# EAGLE design HumanoidArduino (EAGLE 7.7.0)

## Sheet 1 of 2
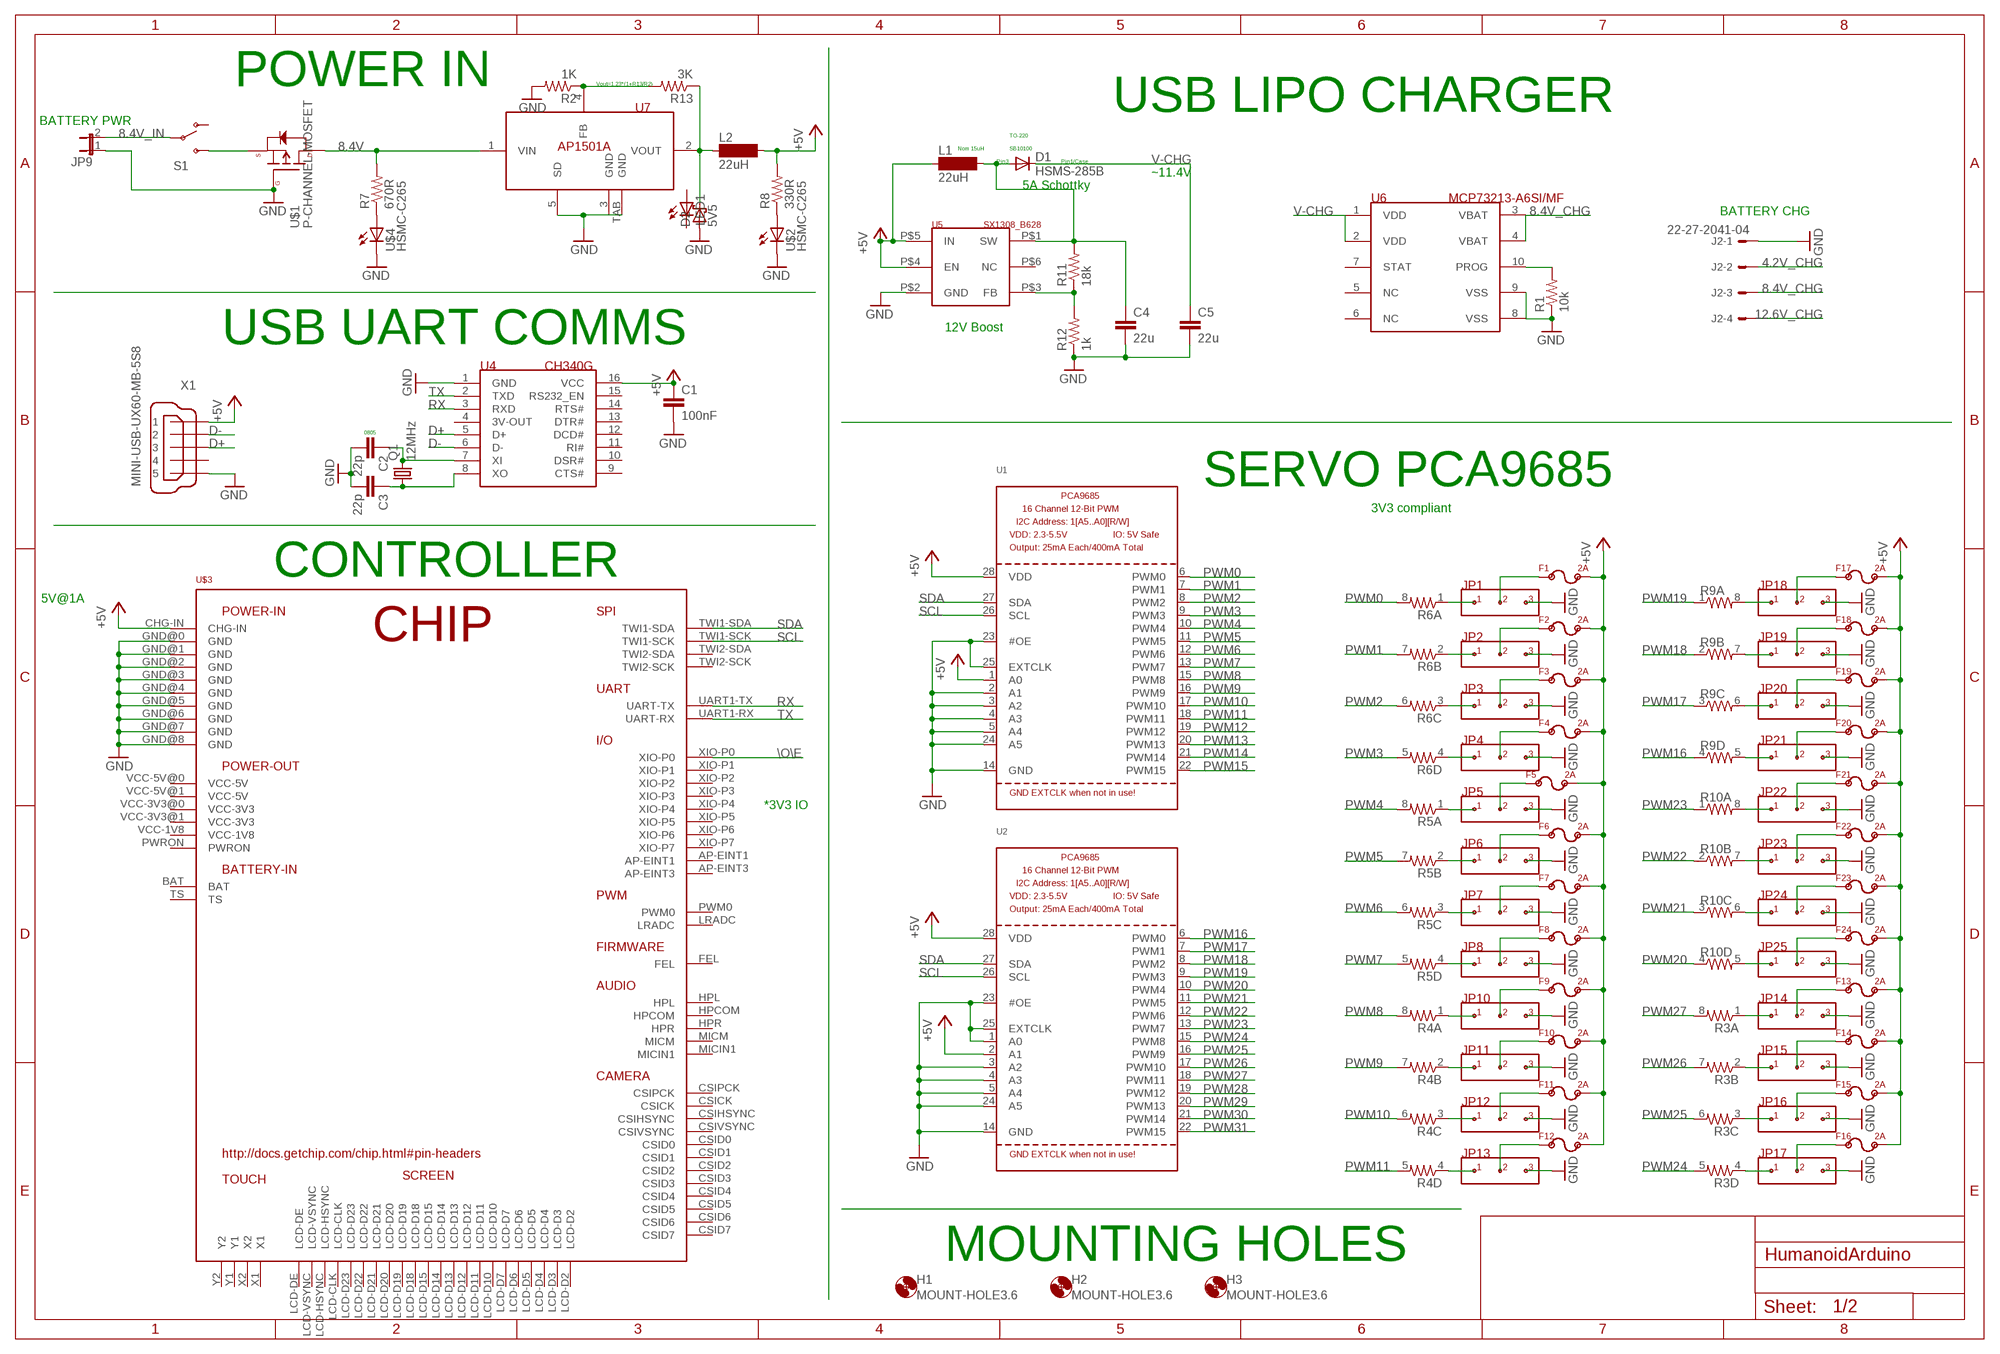
[diagram p0: schematic, sheet 1]

### Parts
C1  100nF  C2,5-3  [C2.5-3]
C2  22p  C2,5-3  [C2.5-3]
C3  22p  C2,5-3  [C2.5-3]
C4  22u  C2,5-3  [C2.5-3]
C5  22u  C2,5-3  [C2.5-3]
D1  HSMS-285B  [SOT323]
D2  5V5  BAT60J  [SOD323_ST]
F1  POLYSWITCH  [1206]
F2  POLYSWITCH  [1206]
F3  POLYSWITCH  [1206]
F4  POLYSWITCH  [1206]
F5  POLYSWITCH  [1206]
F6  POLYSWITCH  [1206]
F7  POLYSWITCH  [1206]
F8  POLYSWITCH  [1206]
F9  POLYSWITCH  [1206]
F10  POLYSWITCH  [1206]
F11  POLYSWITCH  [1206]
F12  POLYSWITCH  [1206]
F13  POLYSWITCH  [1206]
F14  POLYSWITCH  [1206]
F15  POLYSWITCH  [1206]
F16  POLYSWITCH  [1206]
F17  POLYSWITCH  [1206]
F18  POLYSWITCH  [1206]
F19  POLYSWITCH  [1206]
F20  POLYSWITCH  [1206]
F21  POLYSWITCH  [1206]
F22  POLYSWITCH  [1206]
F23  POLYSWITCH  [1206]
F24  POLYSWITCH  [1206]
H1  MOUNT-HOLE3.6  [3,6]
H2  MOUNT-HOLE3.6  [3,6]
H3  MOUNT-HOLE3.6  [3,6]
J2  22-27-2041-04  [6410-04]
JP1  JUMPER_3X1_0.1  [CONN_3X1_0.1"]
JP2  JUMPER_3X1_0.1  [CONN_3X1_0.1"]
JP3  JUMPER_3X1_0.1  [CONN_3X1_0.1"]
JP4  JUMPER_3X1_0.1  [CONN_3X1_0.1"]
JP5  JUMPER_3X1_0.1  [CONN_3X1_0.1"]
JP6  JUMPER_3X1_0.1  [CONN_3X1_0.1"]
JP7  JUMPER_3X1_0.1  [CONN_3X1_0.1"]
JP8  JUMPER_3X1_0.1  [CONN_3X1_0.1"]
JP9  JP1E  [JP1]
JP10  JUMPER_3X1_0.1  [CONN_3X1_0.1"]
JP11  JUMPER_3X1_0.1  [CONN_3X1_0.1"]
JP12  JUMPER_3X1_0.1  [CONN_3X1_0.1"]
JP13  JUMPER_3X1_0.1  [CONN_3X1_0.1"]
JP14  JUMPER_3X1_0.1  [CONN_3X1_0.1"]
JP15  JUMPER_3X1_0.1  [CONN_3X1_0.1"]
JP16  JUMPER_3X1_0.1  [CONN_3X1_0.1"]
JP17  JUMPER_3X1_0.1  [CONN_3X1_0.1"]
JP18  JUMPER_3X1_0.1  [CONN_3X1_0.1"]
JP19  JUMPER_3X1_0.1  [CONN_3X1_0.1"]
JP20  JUMPER_3X1_0.1  [CONN_3X1_0.1"]
JP21  JUMPER_3X1_0.1  [CONN_3X1_0.1"]
JP22  JUMPER_3X1_0.1  [CONN_3X1_0.1"]
JP23  JUMPER_3X1_0.1  [CONN_3X1_0.1"]
JP24  JUMPER_3X1_0.1  [CONN_3X1_0.1"]
JP25  JUMPER_3X1_0.1  [CONN_3X1_0.1"]
L1  22uH  MS85  [MS85]
L2  22uH  MS85  [MS85]
LED1  LEDSML1206  [SML1206]
Q1  12MHz  CSM-7X-DU  [CSM-7X-DU]
R1  10k  RESISTOR0805-RES  [0805]
R2  1K  RESISTOR0805-RES  [0805]
R3  RESISTOR-ARRAY0603-ARV  [0603-ARV]
R4  RESISTOR-ARRAY0603-ARV  [0603-ARV]
R5  RESISTOR-ARRAY0603-ARV  [0603-ARV]
R6  RESISTOR-ARRAY0603-ARV  [0603-ARV]
R7  670R  RESISTOR0805-RES  [0805]
R8  330R  RESISTOR0805-RES  [0805]
R9  RESISTOR-ARRAY0603-ARV  [0603-ARV]
R10  RESISTOR-ARRAY0603-ARV  [0603-ARV]
R11  18k  RESISTOR0805-RES  [0805]
R12  1k  RESISTOR0805-RES  [0805]
R13  3K  RESISTOR0805-RES  [0805]
S1  SWITCH-SPDTPTH_LOCK  [SWITCH-SPDT_LOCK.007S]
U1  PCA9685  [TSSOP28]
U2  PCA9685  [TSSOP28]
U4  CH340G  [SO-16]
U5  SX1308_B628  [SOT23-6]
U6  MCP73213-A6SI/MF  [DFN300X300X100-11N]
U7  AP1501A  [TO-263-5]
U$1  P-CHANNEL-MOSFET  [SOT23-3]
U$2  HSMC-C265  [HSMC-C265]
U$3  CHIP  [CHIP]
U$4  HSMC-C265  [HSMC-C265]
X1  MINI-USB-UX60-MB-5S8  [UX60-MB-5S8]

### Nets
4.2V_CHG: J2.2
8.4V: R7.2 U7.1(VIN) U$1.3(D)
8.4V_CHG: J2.3
8.4V_IN: JP9.2 S1.2(P)
12.6V_CHG: J2.4
+5V: C1.1 F1.P$2 F2.P$2 F3.P$2 F4.P$2 F5.P$2 F6.P$2 F7.P$2 F8.P$2 F9.P$2 F10.P$2 F11.P$2 F12.P$2 F13.P$2 F14.P$2 F15.P$2 F16.P$2 F17.P$2 F18.P$2 F19.P$2 F20.P$2 F21.P$2 F22.P$2 F23.P$2 F24.P$2 L2.2 R8.2 U1.1(A0) U1.28(VDD) U2.2(A1) U2.28(VDD) U4.16(VCC) U$3.CHG-IN X1.1
\O\E: U$3.XIO-P0
D+: U4.5(D+) X1.3
D-: U4.6(D-) X1.2
GND: C1.2 C2.2 C3.2 C4.2 C5.2 D2.A J2.1 JP1.P$3 JP2.P$3 JP3.P$3 JP4.P$3 JP5.P$3 JP6.P$3 JP7.P$3 JP8.P$3 JP9.1 JP10.P$3 JP11.P$3 JP12.P$3 JP13.P$3 JP14.P$3 JP15.P$3 JP16.P$3 JP17.P$3 JP18.P$3 JP19.P$3 JP20.P$3 JP21.P$3 JP22.P$3 JP23.P$3 JP24.P$3 JP25.P$3 R1.1 R2.2 R12.1 U1.2(A1) U1.3(A2) U1.4(A3) U1.5(A4) U1.14(GND) U1.23(#OE) U1.24(A5) U1.25(EXTCLK) U2.1(A0) U2.3(A2) U2.4(A3) U2.5(A4) U2.14(GND) U2.23(#OE) U2.24(A5) U2.25(EXTCLK) U4.1(GND) U5.P$2(GND) U6.9(VSS) U7.5(SD) U7.TAB(GND) U$1.1(G) U$2.C U$3.GND@0(GND) U$3.GND@1(GND) U$3.GND@2(GND) U$3.GND@3(GND) U$3.GND@4(GND) U$3.GND@5(GND) U$3.GND@6(GND) U$3.GND@7(GND) U$3.GND@8(GND) U$4.C X1.5
N$2: JP1.P$1 R6.1
N$3: JP2.P$1 R6.2
N$4: JP3.P$1 R6.3
N$5: JP4.P$1 R6.4
N$6: F3.P$1 JP3.P$2
N$7: F4.P$1 JP4.P$2
N$8: F16.P$1 JP17.P$2
N$9: F15.P$1 JP16.P$2
N$10: F14.P$1 JP15.P$2
N$11: F13.P$1 JP14.P$2
N$12: F12.P$1 JP13.P$2
N$13: F11.P$1 JP12.P$2
N$14: F10.P$1 JP11.P$2
N$15: F9.P$1 JP10.P$2
N$16: F8.P$1 JP8.P$2
N$17: F7.P$1 JP7.P$2
N$18: F6.P$1 JP6.P$2
N$19: F5.P$1 JP5.P$2
N$20: JP5.P$1 R5.1
N$21: JP6.P$1 R5.2
N$22: JP7.P$1 R5.3
N$23: JP8.P$1 R5.4
N$24: JP10.P$1 R4.1
N$25: JP11.P$1 R4.2
N$26: S1.3(S) U$1.2(S)
N$27: F1.P$1 JP1.P$2
N$28: R7.1 U$4.A
N$29: R8.1 U$2.A
N$30: F2.P$1 JP2.P$2
N$31: JP12.P$1 R4.3
N$32: JP13.P$1 R4.4
N$33: JP14.P$1 R3.1
N$34: JP15.P$1 R3.2
N$35: JP16.P$1 R3.3
N$36: JP17.P$1 R3.4
N$38: F21.P$1 JP22.P$2
N$39: F20.P$1 JP21.P$2
N$40: F19.P$1 JP20.P$2
N$41: F18.P$1 JP19.P$2
N$42: F17.P$1 JP18.P$2
N$43: JP18.P$1 R9.8
N$44: JP19.P$1 R9.7
N$45: JP20.P$1 R9.6
N$46: JP21.P$1 R9.5
N$47: JP22.P$1 R10.8
N$48: F22.P$1 JP23.P$2
N$49: F23.P$1 JP24.P$2
N$50: F24.P$1 JP25.P$2
N$53: JP23.P$1 R10.7
N$54: JP24.P$1 R10.6
N$55: JP25.P$1 R10.5
N$56: C2.1 Q1.2 U4.7(XI)
N$57: C3.1 Q1.1 U4.8(XO)
N$58: L1.1 U5.P$4(EN) U5.P$5(IN) ; supply symbol labelled +5V
N$59: R11.1 R12.2 U5.P$3(FB)
N$60: C4.1 D1.1(A) L1.2 R11.2 U5.P$1(SW)
N$62: U6.2(VDD)
N$63: U6.4(VBAT)
N$64: R1.2 U6.10(PROG)
N$65: R2.1 R13.2 U7.4(FB)
N$66: D2.C L2.1 R13.1 U7.2(VOUT)
PWM0: R6.8 U1.6(PWM0)
PWM1: R6.7 U1.7(PWM1)
PWM2: R6.6 U1.8(PWM2)
PWM3: R6.5 U1.9(PWM3)
PWM4: R5.8 U1.10(PWM4)
PWM5: R5.7 U1.11(PWM5)
PWM6: R5.6 U1.12(PWM6)
PWM7: R5.5 U1.13(PWM7)
PWM8: R4.8 U1.15(PWM8)
PWM9: R4.7 U1.16(PWM9)
PWM10: R4.6 U1.17(PWM10)
PWM11: R4.5 U1.18(PWM11)
PWM12: U1.19(PWM12)
PWM13: U1.20(PWM13)
PWM14: U1.21(PWM14)
PWM15: U1.22(PWM15)
PWM16: R9.4 U2.6(PWM0)
PWM17: R9.3 U2.7(PWM1)
PWM18: R9.2 U2.8(PWM2)
PWM19: R9.1 U2.9(PWM3)
PWM20: R10.4 U2.10(PWM4)
PWM21: R10.3 U2.11(PWM5)
PWM22: R10.2 U2.12(PWM6)
PWM23: R10.1 U2.13(PWM7)
PWM24: R3.5 U2.15(PWM8)
PWM25: R3.6 U2.16(PWM9)
PWM26: R3.7 U2.17(PWM10)
PWM27: R3.8 U2.18(PWM11)
PWM28: U2.19(PWM12)
PWM29: U2.20(PWM13)
PWM30: U2.21(PWM14)
PWM31: U2.22(PWM15)
RX: U4.3(RXD) U$3.UART1-TX(UART-TX)
SCL: U1.26(SCL) U2.26(SCL) U$3.TWI1-SCK
SDA: U1.27(SDA) U2.27(SDA) U$3.TWI1-SDA
TX: U4.2(TXD) U$3.UART1-RX(UART-RX)
V-CHG: C5.1 D1.3(C)
Unconnected: LED1.A LED1.C S1.1(O) U4.4(3V-OUT) U4.9(CTS#) U4.10(DSR#) U4.11(RI#) U4.12(DCD#) U4.13(DTR#) U4.14(RTS#) U4.15(RS232_EN) U5.P$6(NC) U6.1(VDD) U6.3(VBAT) U6.5(NC) U6.6(NC) U6.7(STAT) U6.8(VSS) U7.3(GND) U$3.AP-EINT1 U$3.AP-EINT3 U$3.BAT U$3.CSICK U$3.CSID0 U$3.CSID1 U$3.CSID2 U$3.CSID3 U$3.CSID4 U$3.CSID5 U$3.CSID6 U$3.CSID7 U$3.CSIHSYNC U$3.CSIPCK U$3.CSIVSYNC U$3.FEL U$3.HPCOM U$3.HPL U$3.HPR U$3.LCD-CLK U$3.LCD-D2 U$3.LCD-D3 U$3.LCD-D4 U$3.LCD-D5 U$3.LCD-D6 U$3.LCD-D7 U$3.LCD-D10 U$3.LCD-D11 U$3.LCD-D12 U$3.LCD-D13 U$3.LCD-D14 U$3.LCD-D15 U$3.LCD-D18 U$3.LCD-D19 U$3.LCD-D20 U$3.LCD-D21 U$3.LCD-D22 U$3.LCD-D23 U$3.LCD-DE U$3.LCD-HSYNC U$3.LCD-VSYNC U$3.LRADC U$3.MICIN1 U$3.MICM U$3.PWM0 U$3.PWRON U$3.TS U$3.TWI2-SCK U$3.TWI2-SDA U$3.VCC-1V8 U$3.VCC-3V3@0(VCC-3V3) U$3.VCC-3V3@1(VCC-3V3) U$3.VCC-5V@0(VCC-5V) U$3.VCC-5V@1(VCC-5V) U$3.X1 U$3.X2 U$3.XIO-P1 U$3.XIO-P2 U$3.XIO-P3 U$3.XIO-P4 U$3.XIO-P5 U$3.XIO-P6 U$3.XIO-P7 U$3.Y1 U$3.Y2 X1.4

### Notes on the sheet
- POWER IN | Vout=1.23*(1+R13/R2)
- USB LIPO CHARGER
- BATTERY PWR
- TO-220
- Nom 15uH | SB10100
- Pin3 | Pin1/Case
- ~11.4V
- 5A Schottky
- BATTERY CHG
- 12V Boost
- USB UART COMMS
- 0805
- SERVO PCA9685
- ￼ ✓ 3V3 compliant
- CONTROLLER
- 5V@1A
- *3V3 IO
- MOUNTING HOLES

## Sheet 2 of 2

## Library data of the parts
C1-C5 = capacitor-wima:C: CAPACITOR naming: grid - package width
D1 = avago:HSMS-285B: Surface Mount Microwave Schottky Detector Diodes Source: Data sheet <http://www.farnell.com/datasheets/461166.pdf>
D2 = diode:BAT60J: Schottky barrier diode Source: www.st.com, BAT60J.pdf
F1-F24 = HumanoidLbr:POLYSWITCH; CURRENT: 2A
H1-H3 = holes:MOUNT-HOLE: MOUNTING HOLE with drill center marker
J2 = con-molex:22-?-04: CONNECTOR wire to board 2.54 mm (.1 inch) pitch header; OC_FARNELL: unknown; OC_NEWARK: unknown
JP1-JP8 JP10-JP25 = HumanoidLbr:JUMPER_3X1_0.1
JP9 = jumper:JP1E: JUMPER
L1 L2 = inductor-neosid:MS85: INDUCTOR SMD power inductor; OC_FARNELL: unknown; OC_NEWARK: unknown
LED1 = led:LED: LED OSRAM: - CHIPLED LG R971, LG N971, LY N971, LG Q971, LY Q971, LO R971, LY R971 LH N974, LH R974 LS Q976, LO Q976, LY Q976 LO Q996 - Hyper CHIPLED LW Q18S LB Q993, LB Q99A, LB R99A - SideLED LS A670, LO A670, LY A670, LG A670, LP A670 LB A673, LV A673, LT A673, LW A673 LH A674 LY A675 LS A676, LA A676, LO A676, LY A676, LW A676 LS A679, LY A679, LG A679 - Hyper Micro SIDELED® LS Y876, LA Y876, LO Y876, LY Y876 LT Y87S - SmartLED LW L88C, LW L88S LB L89C, LB L89S, LG L890 LS L89K, LO L89K, LY L89K LS L896, LA L896, LO L896, LY L896 - TOPLED LS T670, LO T670, LY T670, LG T670, LP T670 LSG T670, LSP T670, LSY T670, LOP T670, LYG T670 LG T671, LOG T671, LSG T671 LB T673, LV T673, LT T673, LW T673 LH T674 LS T676, LA T676, LO T676, LY T676, LB T676, LH T676, LSB T676, LW T676 LB T67C, LV T67C, LT T67C, LS T67K, LO T67K, LY T67K, LW E67C LS E67B, LA E67B, LO E67B, LY E67B, LB E67C, LV E67C, LT E67C LW T67C LS T679, LY T679, LG T679 LS T770, LO T770, LY T770, LG T770, LP T770 LB T773, LV T773, LT T773, LW T773 LH T774 LS E675, LA E675, LY E675, LS T675 LS T776, LA T776, LO T776, LY T776, LB T776 LHGB T686 LT T68C, LB T68C - Hyper Mini TOPLED® LB M676 - Mini TOPLED Santana® LG M470 LS M47K, LO M47K, LY M47K Source: http://www.osram.convergy.de LUXEON: - LUMILED® LXK2-PW12-R00, LXK2-PW12-S00, LXK2-PW14-U00, LXK2-PW14-V00 LXK2-PM12-R00, LXK2-PM12-S00, LXK2-PM14-U00 LXK2-PE12-Q00, LXK2-PE12-R00, LXK2-PE12-S00, LXK2-PE14-T00, LXK2-PE14-U00 LXK2-PB12-K00, LXK2-PB12-L00, LXK2-PB12-M00, LXK2-PB14-N00, LXK2-PB14-P00, LXK2-PB14-Q00 LXK2-PR12-L00, LXK2-PR12-M00, LXK2-PR14-Q00, LXK2-PR14-R00 LXK2-PD12-Q00, LXK2-PD12-R00, LXK2-PD12-S00 LXK2-PH12-R00, LXK2-PH12-S00 LXK2-PL12-P00, LXK2-PL12-Q00, LXK2-PL12-R00 Source: www.luxeon.com KINGBRIGHT: KA-3528ASYC Source: www.kingbright.com
Q1 = crystal:CSM-7X-DU: SMD CRYSTAL Source: www.ecsxtal.com .. Crystal 3.6864MHz CSM_7X_DU.PDF; OC_FARNELL: unknown; OC_NEWARK: unknown
R1 R2 R7 R8 R11-R13 = SparkFun-Passives:RESISTOR: Resistor Basic schematic elements and footprints for 0603, 1206, and PTH resistors.
R3-R6 R9 R10 = SparkFun-Resistors:RESISTOR-ARRAY: Array Chip Resistor Source: RS Component / Phycomp
S1 = SparkFun-Electromechanical:SWITCH-SPDT: SPDT Switch Simple slide switch, Spark Fun Electronics SKU : COM-00102 DPDT SMT slide switch, AYZ0202, SWCH-08179
U1 U2 = adafruit:PCA9685: PCA9685 - 16 Channel 12-Bit I2C PWM Controller 5.0V tolerant 16 channel, 12-bit I2C PWM controller with 25mA per output (max. 400mA total) Digikey: 568-5931-1-ND
U4 = HumanoidLbr:CH340G
U5 = HumanoidLbr:SX1308_B628
U6 = DFN300X300X100-11N:MCP73213-A6SI/MF
U7 = TO-263-5:AP1501A
U$1 = GeekAmmo:P-CHANNEL-MOSFET: P-Channel MOSFET Mode Field Effect Transistor
U$2 U$4 = SparkFun-Retired:HSMC-C265: RETIRED Avago HSMC-C265 reverse-mounted red LED This is a SMD LED that is mounted to one side of a PCB and shines through a hole to the other side of the PCB. Useful for making boards with no components on one side for mounting and having LED indicator lights shine through the board, panel, etc.
U$3 = ZMZE:CHIP
X1 = con-hirose:MINI-USB-: MINI USB Connector Source: http://www.hirose.co.jp/cataloge_hp/e24000019.pdf; OC_FARNELL: unknown; OC_NEWARK: unknown

## Board
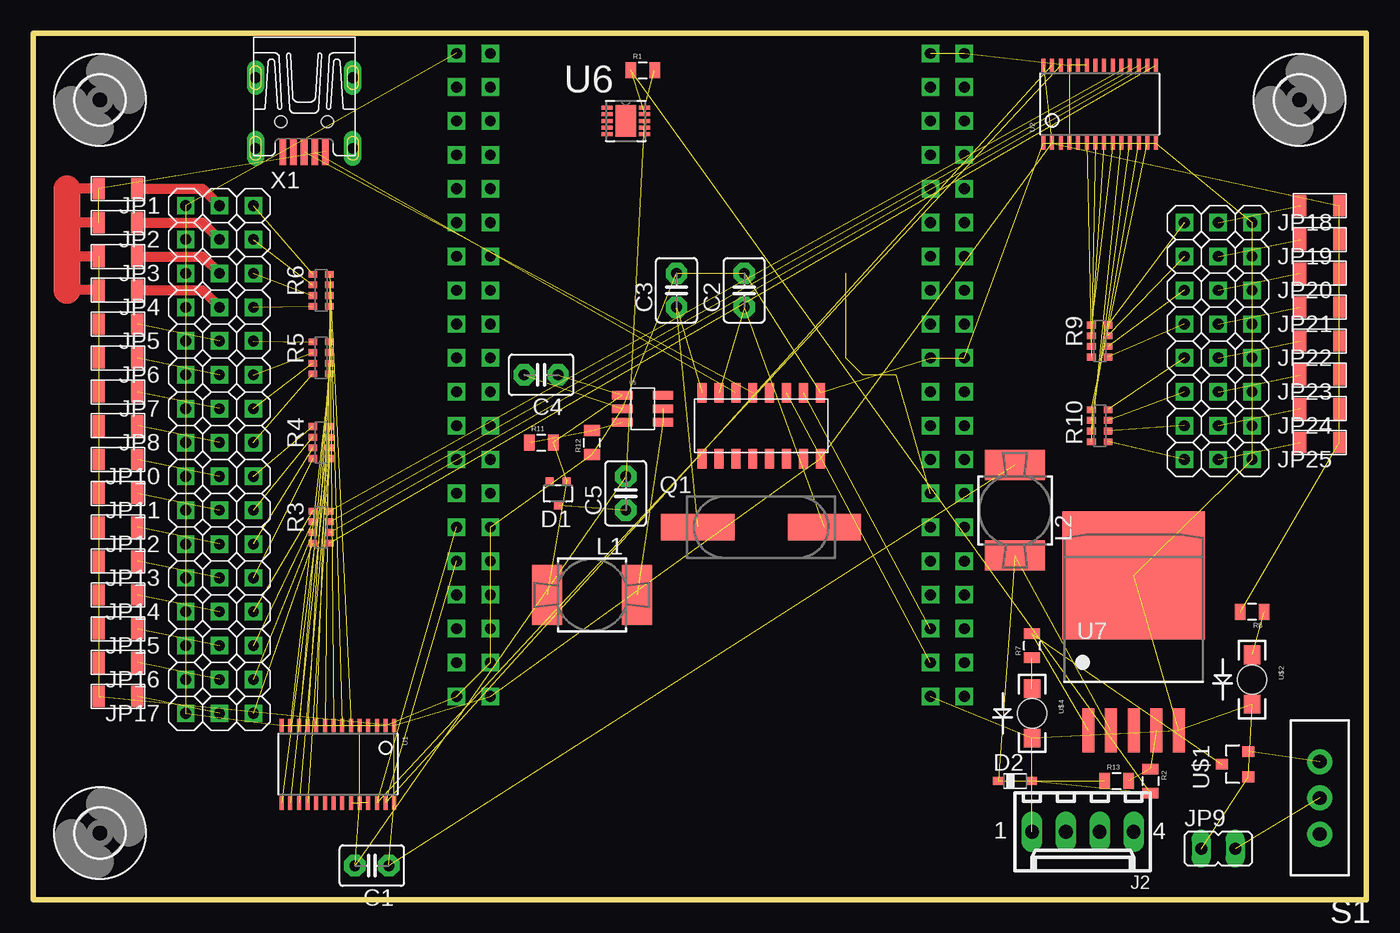
[diagram p1: board, top side]
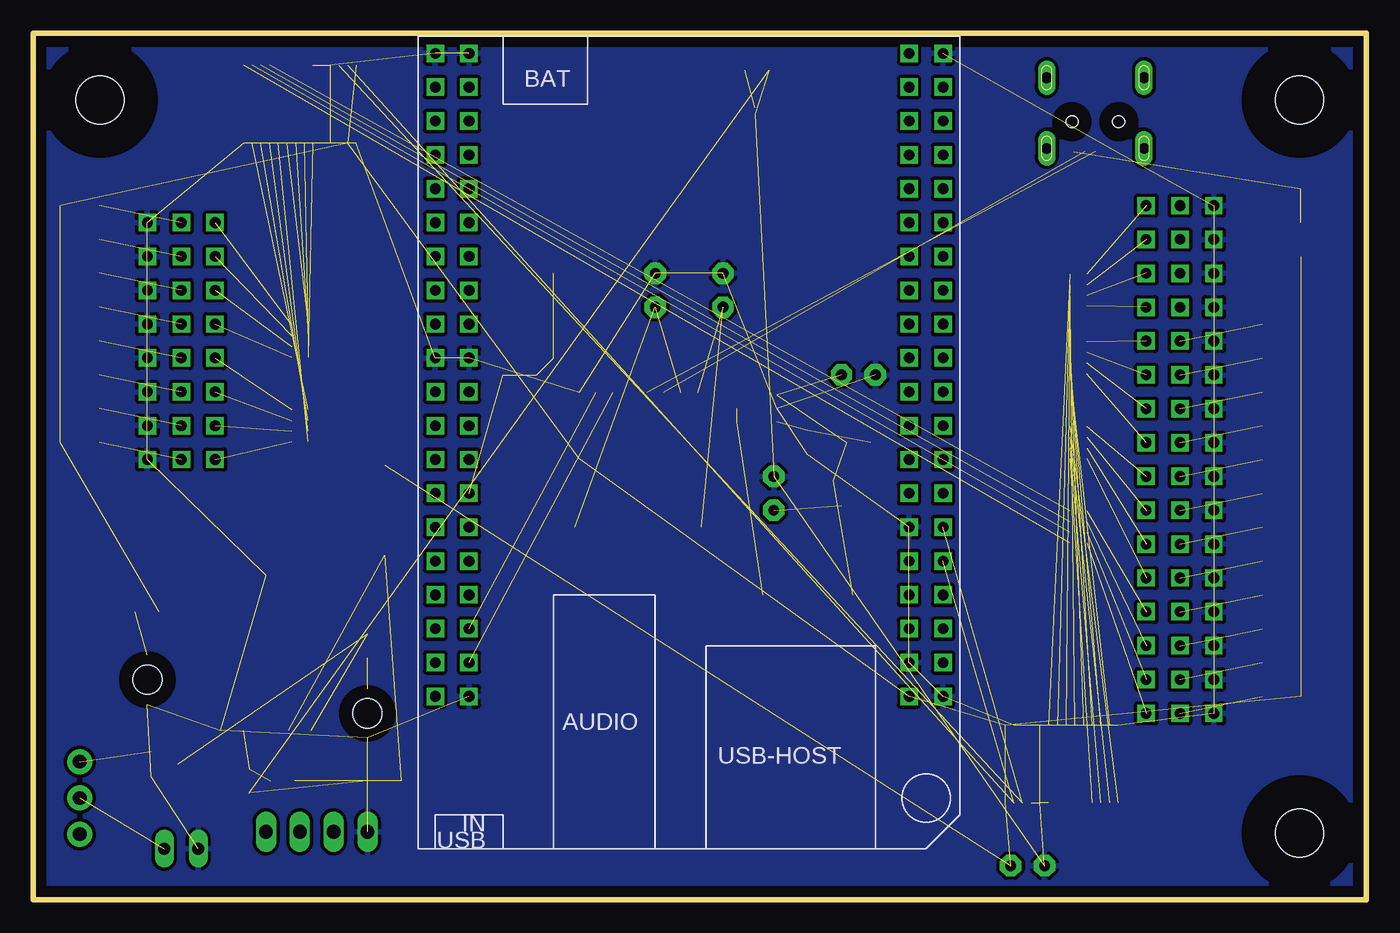
[diagram p2: board, bottom side, seen from below]

Size 100 x 65 mm. Coordinates in mm from the lower left corner, seen from the top.
Outline: 0,0 100,0 100,65 0,65 0,0
Copper layers (1*16): Top 0.035mm / dielectric 1.5mm / Bottom 0.035mm
Design rules "default": minimum track width 10mil, minimum drill 24mil, track to track 8mil, track to pad 8mil, pad to pad 8mil, via to via 8mil, smd to smd 8mil, copper to edge 40mil, drill to drill 8mil, minimum pad ring 10mil, minimum via ring 8mil, stop-mask expansion 4mil, vias tented up to drill 0mil, thermal gap 10mil
Milling: 4 lines

### Footprints (pad centres in the part's own frame; a part is rotated, then mirrored left to right if it is on the bottom)
C2.5-3 = drill 0.813 pad 1.6 octagon: 1 -1.27,0; 2 1.27,0
SOT323 = smd 0.6 x 0.55: 1 -0.65,-0.925; 2 0.65,-0.925; 3 0,0.925
SOD323_ST = smd 0.8 x 0.6: A 1.25,0; C -1.25,0
1206 = smd 0.9 x 1.6: P$1 1.45,0; P$2 -1.45,0
3,6 = hole 3.6: 0,0
6410-04 = drill 1.016 long: 1 3.81,0; 2 1.27,0; 3 -1.27,0; 4 -3.81,0
CONN_3X1_0.1" = drill 0.8 square: P$1 -2.54,0; P$2 0,0; P$3 2.54,0
JP1 = drill 0.914 long: 1 0,-1.27; 2 0,1.27
MS85 = smd 4.5 x 2.25: 1 0,-3.383; 2 0,3.383
SML1206 = smd 1.5 x 1.5: A 1.75,0; C -1.75,0
CSM-7X-DU = smd 5.5 x 2: 1 -4.75,0; 2 4.75,0
0805 = smd 0.8 x 1.2: 1 -0.9,0; 2 0.9,0
0603-ARV = smd 0.5 x 0.65: 1 -1.2,-0.625; 2 -0.4,-0.625; 3 0.4,-0.625; 4 1.2,-0.625; 5 1.2,0.625; 6 0.4,0.625; 7 -0.4,0.625; 8 -1.2,0.625
SWITCH-SPDT_LOCK.007S = drill 1.016 pad 1.88: 1 0,2.718; 2 0,0; 3 0,-2.718
TSSOP28 = smd 0.305 x 0.991: 1 -4.225,-2.918; 2 -3.575,-2.918; 3 -2.925,-2.918; 4 -2.275,-2.918; 5 -1.625,-2.918; 6 -0.975,-2.918; 7 -0.325,-2.918; 8 0.325,-2.918; 9 0.975,-2.918; 10 1.625,-2.918; 11 2.275,-2.918; 12 2.925,-2.918; 13 3.575,-2.918; 14 4.225,-2.918; 15 4.225,2.918; 16 3.575,2.918; 17 2.925,2.918; 18 2.275,2.918; 19 1.625,2.918; 20 0.975,2.918; 21 0.325,2.918; 22 -0.325,2.918; 23 -0.975,2.918; 24 -1.625,2.918; 25 -2.275,2.918; 26 -2.925,2.918; 27 -3.575,2.918; 28 -4.225,2.918
SO-16 = smd 1.45 x 0.67: 1 -2.475,4.445; 2 -2.475,3.175; 3 -2.475,1.905; 4 -2.475,0.635; 5 -2.475,-0.635; 6 -2.475,-1.905; 7 -2.475,-3.175; 8 -2.475,-4.445; 9 2.475,-4.445; 10 2.475,-3.175; 11 2.475,-1.905; 12 2.475,-0.635; 13 2.475,0.635; 14 2.475,1.905; 15 2.475,3.175; 16 2.475,4.445
SOT23-6 = smd 1.524 x 0.635: P$1 -1.524,1.016; P$2 -1.524,0; P$3 -1.524,-1.016; P$4 1.524,-1.016; P$5 1.524,0; P$6 1.524,1.016
DFN300X300X100-11N = smd 0.813 x 0.305: 1 -1.397,0.991; 2 -1.397,0.508; 3 -1.397,0; 4 -1.397,-0.508; 5 -1.397,-0.991; 6 1.397,-0.991; 7 1.397,-0.508; 8 1.397,0; 9 1.397,0.508; 10 1.397,0.991 | smd 1.575 x 2.362: 11 0,0
TO-263-5 = smd 0.9 x 3.3: 1 -3.4,0; 2 -1.7,0; 3 0,0; 4 1.7,0; 5 3.4,0 | smd 10.7 x 9.6: TAB 0,11.616
SOT23-3 = smd 0.8 x 0.9: 1 -0.95,-1; 2 0.95,-1; 3 0,1
HSMC-C265 = smd 1.4 x 1.25: A -1.85,0; C 1.85,0 | hole 2.2: 0,0
CHIP = drill 0.8 square: AP-EINT1 35.56,20.32; AP-EINT3 38.1,20.32; BAT 2.54,40.64; CHG-IN 2.54,48.26; CSICK 38.1,15.24; CSID0 35.56,10.16; CSID1 38.1,10.16; CSID2 35.56,7.62; CSID3 38.1,7.62; CSID4 35.56,5.08; CSID5 38.1,5.08; CSID6 35.56,2.54; CSID7 38.1,2.54; CSIHSYNC 35.56,12.7; CSIPCK 35.56,15.24; CSIVSYNC 38.1,12.7; FEL 35.56,40.64; GND@0 0,48.26; GND@1 2.54,45.72; GND@2 2.54,35.56; GND@3 0,0; GND@4 35.56,48.26; GND@5 35.56,22.86; GND@6 38.1,22.86; GND@7 35.56,0; GND@8 38.1,0; HPCOM 38.1,43.18; HPL 38.1,45.72; HPR 38.1,40.64; LCD-CLK 0,5.08; LCD-D2 0,27.94; LCD-D3 2.54,25.4; LCD-D4 0,25.4; LCD-D5 2.54,22.86; LCD-D6 0,22.86; LCD-D7 2.54,20.32; LCD-D10 0,20.32; LCD-D11 2.54,17.78; LCD-D12 0,17.78; LCD-D13 2.54,15.24; LCD-D14 0,15.24; LCD-D15 2.54,12.7; LCD-D18 0,12.7; LCD-D19 2.54,10.16; LCD-D20 0,10.16; LCD-D21 2.54,7.62; LCD-D22 0,7.62; LCD-D23 2.54,5.08; LCD-DE 2.54,0; LCD-HSYNC 2.54,2.54; LCD-VSYNC 0,2.54; LRADC 35.56,35.56; MICIN1 38.1,35.56; MICM 38.1,38.1; PWM0 2.54,27.94; PWRON 2.54,38.1; TS 2.54,43.18; TWI1-SCK 0,35.56; TWI1-SDA 0,38.1; TWI2-SCK 38.1,17.78; TWI2-SDA 35.56,17.78; UART1-RX 35.56,43.18; UART1-TX 35.56,45.72; VCC-1V8 0,40.64; VCC-3V3@0 0,43.18; VCC-3V3@1 35.56,38.1; VCC-5V@0 0,45.72; VCC-5V@1 38.1,48.26; X1 0,33.02; X2 2.54,33.02; XIO-P0 35.56,33.02; XIO-P1 38.1,33.02; XIO-P2 35.56,30.48; XIO-P3 38.1,30.48; XIO-P4 35.56,27.94; XIO-P5 38.1,27.94; XIO-P6 35.56,25.4; XIO-P7 38.1,25.4; Y1 0,30.48; Y2 2.54,30.48
UX60-MB-5S8 = smd 2 x 0.5: 1 8.65,1.6; 2 8.65,0.8; 3 8.65,0; 4 8.65,-0.8; 5 8.65,-1.6 | drill 0.8 long: M1 3.1,-3.65; M2 3.1,3.65; M3 8.4,3.65; M4 8.4,-3.65 | hole 0.9: 6.4,-1.75; 6.4,1.75

### Placement (x,y rotation side)
C1  25.4,2.54 180 top
C2  53.34,45.72 90 top
C3  48.26,45.72 90 top
C4  38.1,39.37 180 top
C5  44.45,30.48 90 top
D1  39.37,30.48 180 top
D2  73.66,8.89 0 top
F1  6.35,53.34 0 top
F2  6.35,50.8 0 top
F3  6.35,48.26 0 top
F4  6.35,45.72 0 top
F5  6.35,43.18 0 top
F6  6.35,40.64 0 top
F7  6.35,38.1 0 top
F8  6.35,35.56 0 top
F9  6.35,33.02 0 top
F10  6.35,30.48 0 top
F11  6.35,27.94 0 top
F12  6.35,25.4 0 top
F13  6.35,22.86 0 top
F14  6.35,20.32 0 top
F15  6.35,17.78 0 top
F16  6.35,15.24 0 top
F17  96.52,52.07 180 top
F18  96.52,49.53 180 top
F19  96.52,46.99 180 top
F20  96.52,44.45 180 top
F21  96.52,41.91 180 top
F22  96.52,39.37 180 top
F23  96.52,36.83 180 top
F24  96.52,34.29 180 top
H1  5,5 0 top
H2  5,60 0 top
H3  95,60 0 top
J2  78.74,5.08 180 top
JP1  13.97,52.07 180 top
JP2  13.97,49.53 180 top
JP3  13.97,46.99 180 top
JP4  13.97,44.45 180 top
JP5  13.97,41.91 180 top
JP6  13.97,39.37 180 top
JP7  13.97,36.83 180 top
JP8  13.97,34.29 180 top
JP9  88.9,3.81 270 top
JP10  13.97,31.75 180 top
JP11  13.97,29.21 180 top
JP12  13.97,26.67 180 top
JP13  13.97,24.13 180 top
JP14  13.97,21.59 180 top
JP15  13.97,19.05 180 top
JP16  13.97,16.51 180 top
JP17  13.97,13.97 180 top
JP18  88.9,50.8 0 top
JP19  88.9,48.26 0 top
JP20  88.9,45.72 0 top
JP21  88.9,43.18 0 top
JP22  88.9,40.64 0 top
JP23  88.9,38.1 0 top
JP24  88.9,35.56 0 top
JP25  88.9,33.02 0 top
L1  41.91,22.86 90 top
L2  73.66,29.21 0 top
LED1  5.08,-8.89 0 top  (outside the outline)
Q1  54.61,27.94 0 top
R1  45.72,62.23 0 top
R2  83.82,8.89 270 top
R3  21.59,27.94 270 top
R4  21.59,34.29 270 top
R5  21.59,40.64 270 top
R6  21.59,45.72 270 top
R7  74.93,19.05 90 top
R8  91.44,21.59 180 top
R9  80.01,41.91 270 top
R10  80.01,35.56 270 top
R11  38.1,34.29 0 top
R12  41.91,34.29 90 top
R13  81.28,8.89 0 top
S1  96.52,7.62 180 top
U1  22.86,10.16 180 top
U2  80.01,59.69 0 top
U4  54.61,35.56 270 top
U5  45.72,36.83 0 top
U6  44.45,58.42 0 top
U7  82.55,12.7 0 top
U$1  90.17,10.16 90 top
U$2  91.44,16.51 270 top
U$3  31.75,63.5 180 bottom
U$4  74.93,13.97 270 top
X1  20.32,64.77 270 top

### Tracks (layer width: path | path; a pad name or v marks a point on that pad's centre or on a via)
8.4V  (2 unrouted)
8.4V_IN  (1 unrouted)
+5V  (32 unrouted)
  Top 0.762: F4.P$2 2.54,45.72 | F3.P$2 2.54,48.26 | F2.P$2 2.54,50.8 | F1.P$2 2.54,53.34
  Top 2.032: 2.54,45.72 2.54,53.34
\O\E  (4 unrouted)
D+  (1 unrouted)
D-  (1 unrouted)
GND  (68 unrouted)
  pour Bottom (isolate 0.254): 0,0 0,65 100,65 100,0
N$2  (1 unrouted)
N$3  (1 unrouted)
N$4  (1 unrouted)
N$5  (1 unrouted)
N$6
  Top 0.762: F3.P$1 12.7,48.26 JP3.P$2
N$7
  Top 0.762: F4.P$1 12.7,45.72 JP4.P$2
N$8  (1 unrouted)
N$9  (1 unrouted)
N$10  (1 unrouted)
N$11  (1 unrouted)
N$12  (1 unrouted)
N$13  (1 unrouted)
N$14  (1 unrouted)
N$15  (1 unrouted)
N$16  (1 unrouted)
N$17  (1 unrouted)
N$18  (1 unrouted)
N$19  (1 unrouted)
N$20  (1 unrouted)
N$21  (1 unrouted)
N$22  (1 unrouted)
N$23  (1 unrouted)
N$24  (1 unrouted)
N$25  (1 unrouted)
N$26  (1 unrouted)
N$27
  Top 0.762: F1.P$1 12.7,53.34 JP1.P$2
N$28  (1 unrouted)
N$29  (1 unrouted)
N$30
  Top 0.762: F2.P$1 12.7,50.8 JP2.P$2
N$31  (1 unrouted)
N$32  (1 unrouted)
N$33  (1 unrouted)
N$34  (1 unrouted)
N$35  (1 unrouted)
N$36  (1 unrouted)
N$38  (1 unrouted)
N$39  (1 unrouted)
N$40  (1 unrouted)
N$41  (1 unrouted)
N$42  (1 unrouted)
N$43  (1 unrouted)
N$44  (1 unrouted)
N$45  (1 unrouted)
N$46  (1 unrouted)
N$47  (1 unrouted)
N$48  (1 unrouted)
N$49  (1 unrouted)
N$50  (1 unrouted)
N$53  (1 unrouted)
N$54  (1 unrouted)
N$55  (1 unrouted)
N$56  (2 unrouted)
N$57  (2 unrouted)
N$58  (2 unrouted)
N$59  (2 unrouted)
N$60  (4 unrouted)
N$64  (1 unrouted)
N$65  (2 unrouted)
N$66  (3 unrouted)
PWM0  (1 unrouted)
PWM1  (1 unrouted)
PWM2  (1 unrouted)
PWM3  (1 unrouted)
PWM4  (1 unrouted)
PWM5  (1 unrouted)
PWM6  (1 unrouted)
PWM7  (1 unrouted)
PWM8  (1 unrouted)
PWM9  (1 unrouted)
PWM10  (1 unrouted)
PWM11  (1 unrouted)
PWM16  (1 unrouted)
PWM17  (1 unrouted)
PWM18  (1 unrouted)
PWM19  (1 unrouted)
PWM20  (1 unrouted)
PWM21  (1 unrouted)
PWM22  (1 unrouted)
PWM23  (1 unrouted)
PWM24  (1 unrouted)
PWM25  (1 unrouted)
PWM26  (1 unrouted)
PWM27  (1 unrouted)
RX  (1 unrouted)
SCL  (2 unrouted)
SDA  (2 unrouted)
TX  (1 unrouted)
V-CHG  (1 unrouted)

### Text on the board
Document: BATTERY